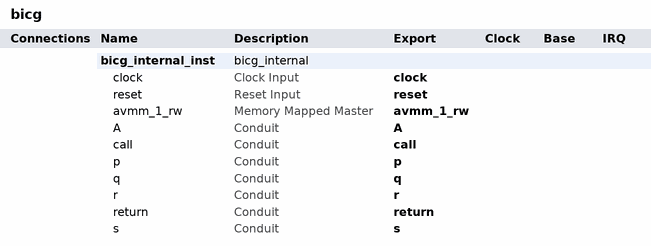
[diagram p0: system contents]
# Platform Designer (Qsys) system bicg, Cyclone V 5CSEMA4U23C7
# Parameters at their usual value, and those the tool derives, are not listed.
package require qsys
create_system bicg
set_project_property DEVICE_FAMILY {Cyclone V}
set_project_property DEVICE 5CSEMA4U23C7

add_instance bicg_internal_inst bicg_internal 1.0
set_instance_property bicg_internal_inst AUTO_EXPORT true

# exported interfaces
add_interface A conduit end
set_interface_property A EXPORT_OF bicg_internal_inst.A
add_interface avmm_1_rw avalon master
set_interface_property avmm_1_rw EXPORT_OF bicg_internal_inst.avmm_1_rw
add_interface call conduit end
set_interface_property call EXPORT_OF bicg_internal_inst.call
add_interface clock clock sink
set_interface_property clock EXPORT_OF bicg_internal_inst.clock
add_interface p conduit end
set_interface_property p EXPORT_OF bicg_internal_inst.p
add_interface q conduit end
set_interface_property q EXPORT_OF bicg_internal_inst.q
add_interface r conduit end
set_interface_property r EXPORT_OF bicg_internal_inst.r
add_interface reset reset sink
set_interface_property reset EXPORT_OF bicg_internal_inst.reset
add_interface return conduit end
set_interface_property return EXPORT_OF bicg_internal_inst.return
add_interface s conduit end
set_interface_property s EXPORT_OF bicg_internal_inst.s

set_interconnect_requirement {$system} qsys_mm.clockCrossingAdapter HANDSHAKE
set_interconnect_requirement {$system} qsys_mm.enableEccProtection FALSE
set_interconnect_requirement {$system} qsys_mm.insertDefaultSlave FALSE
set_interconnect_requirement {$system} qsys_mm.maxAdditionalLatency 1

save_system bicg.qsys
